# Altium project WiFi_Card_V1_1.PrjPcb
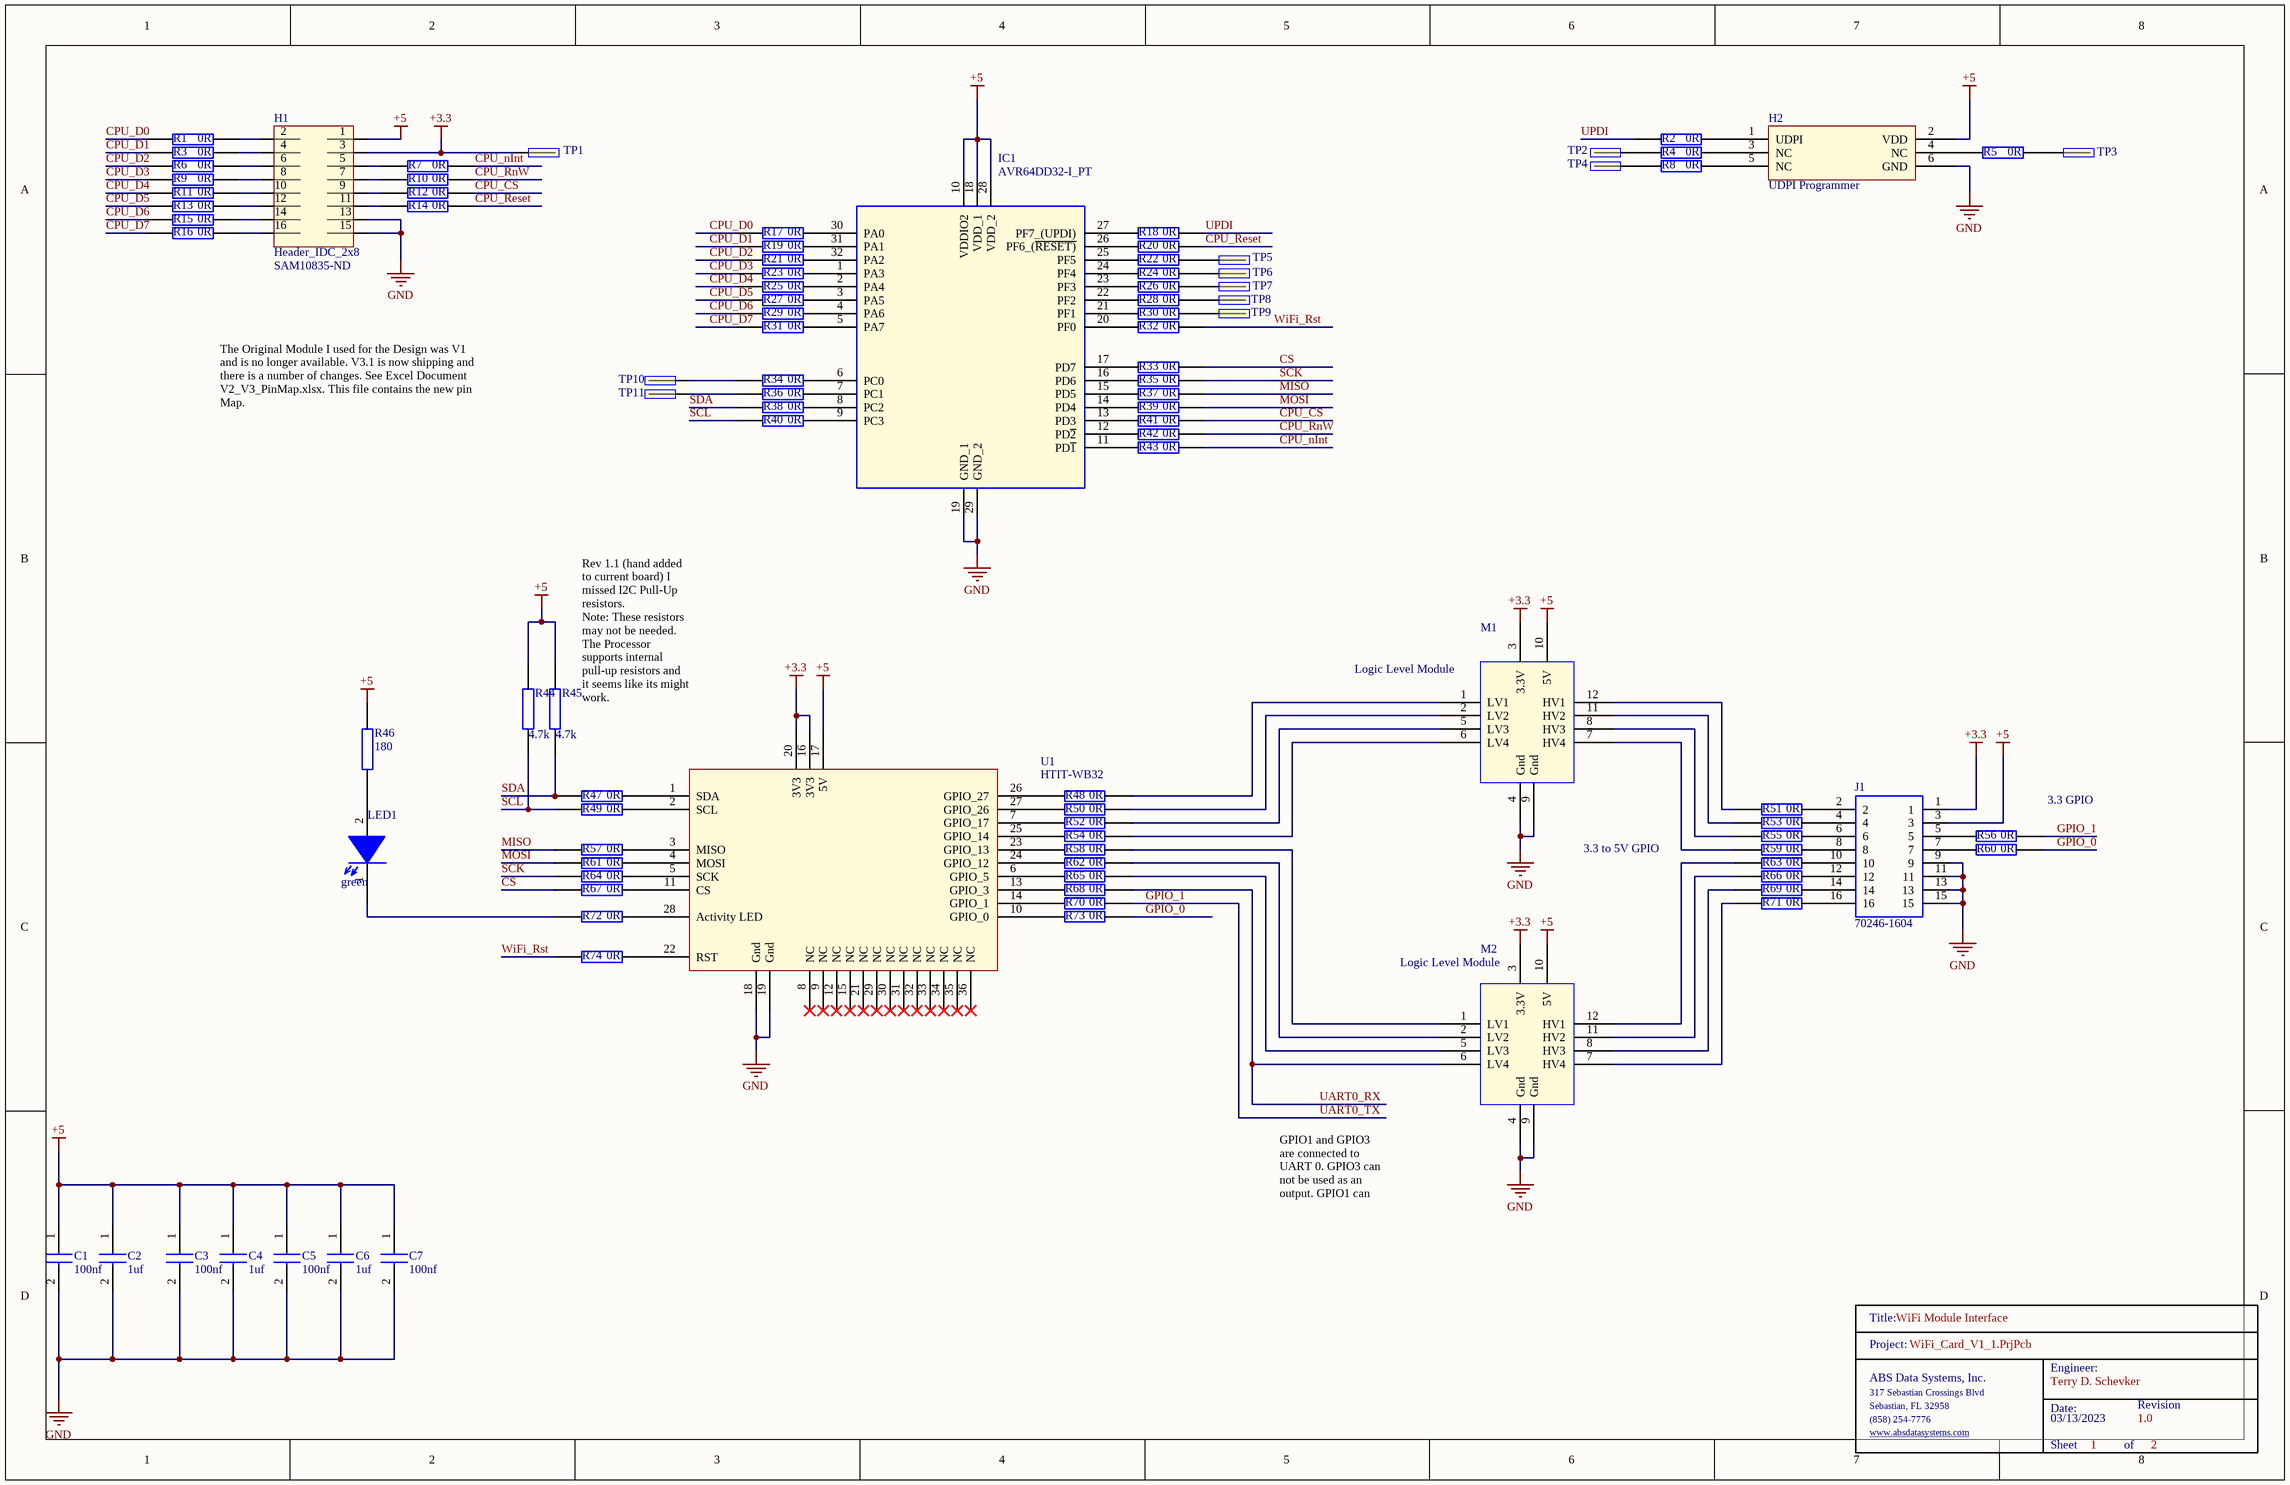
[diagram p0: WiFi_Card.SchDoc]
2 sheets, 153 parts. Net scope: global (net labels, ports and power ports of the same name join across sheets).
Board file: WiFi_Card_PCB.PcbDoc
Sheets:
  WiFi_Card.SchDoc
  WiFi_Card_Led_Monitor.SchDoc

## Sheet WiFi_Card.SchDoc: WiFi Module Interface
size Tabloid; Date: 03/13/2023; Engineer: Terry D. Schevker; Revision: 1.0; SheetNumber: 1; SheetTotal: 2

### Parts
C1  100nf  [0603]
C2  1uf  [0603]
C3  100nf  [0603]
C4  1uf  [0603]
C5  100nf  [0603]
C6  1uf  [0603]
C7  100nf  [0603]
H1  Header_IDC_2x8  Supplier Part Number 1: SAM10835-ND  [HEADER16]
H2  UDPI Programmer  [HDR2X3]
IC1  AVR64DD32-I_PT  [QFP80P900X900X120-32N]
J1  70246-1604  [SHDR16W99P254_2X8_2794X889X927P]
LED1  green  [0603_Diode]
M1  Logic Level Module  [Logic_Level_Module]
M2  Logic Level Module  [Logic_Level_Module]
R1  0R  [0603]
R2  0R  [0603]
R3  0R  [0603]
R4  0R  [0603]
R5  0R  [0603]
R6  0R  [0603]
R7  0R  [0603]
R8  0R  [0603]
R9  0R  [0603]
R10  0R  [0603]
R11  0R  [0603]
R12  0R  [0603]
R13  0R  [0603]
R14  0R  [0603]
R15  0R  [0603]
R16  0R  [0603]
R17  0R  [0603]
R18  0R  [0603]
R19  0R  [0603]
R20  0R  [0603]
R21  0R  [0603]
R22  0R  [0603]
R23  0R  [0603]
R24  0R  [0603]
R25  0R  [0603]
R26  0R  [0603]
R27  0R  [0603]
R28  0R  [0603]
R29  0R  [0603]
R30  0R  [0603]
R31  0R  [0603]
R32  0R  [0603]
R33  0R  [0603]
R34  0R  [0603]
R35  0R  [0603]
R36  0R  [0603]
R37  0R  [0603]
R38  0R  [0603]
R39  0R  [0603]
R40  0R  [0603]
R41  0R  [0603]
R42  0R  [0603]
R43  0R  [0603]
R44  4.7k  [0603]
R45  4.7k  [0603]
R46  180  [0603]
R47  0R  [0603]
R48  0R  [0603]
R49  0R  [0603]
R50  0R  [0603]
R51  0R  [0603]
R52  0R  [0603]
R53  0R  [0603]
R54  0R  [0603]
R55  0R  [0603]
R56  0R  [0603]
R57  0R  [0603]
R58  0R  [0603]
R59  0R  [0603]
R60  0R  [0603]
R61  0R  [0603]
R62  0R  [0603]
R63  0R  [0603]
R64  0R  [0603]
R65  0R  [0603]
R66  0R  [0603]
R67  0R  [0603]
R68  0R  [0603]
R69  0R  [0603]
R70  0R  [0603]
R71  0R  [0603]
R72  0R  [0603]
R73  0R  [0603]
R74  0R  [0603]
TitleBlock_1  TitleBlock  (value not drawn)  (graphical)
TP1  TP  [TP]  (value not drawn)
TP2  TP  [TP]  (value not drawn)
TP3  TP  [TP]  (value not drawn)
TP4  TP  [TP]  (value not drawn)
TP5  TP  [TP]  (value not drawn)
TP6  TP  [TP]  (value not drawn)
TP7  TP  [TP]  (value not drawn)
TP8  TP  [TP]  (value not drawn)
TP9  TP  [TP]  (value not drawn)
TP10  TP  [TP]  (value not drawn)
TP11  TP  [TP]  (value not drawn)
U1  HTIT-WB32  [DIP36Wide]

### Nets
+3.3: H1.3 J1.1 M1.3(3.3V) M2.3(3.3V) TP1.1 U1.16(3V3) U1.20(3V3)
+5: C1.1 C2.1 C3.1 C4.1 C5.1 C6.1 C7.1 H1.1 H2.2(VDD) IC1.10(VDDIO2) IC1.18(VDD_1) IC1.28(VDD_2) J1.3 M1.10(5V) M2.10(5V) R44.2 R45.2 R46.2 U1.17(5V)
GND: C1.2 C2.2 C3.2 C4.2 C5.2 C6.2 C7.2 H1.13 H1.15 H2.6(GND) IC1.19(GND_1) IC1.29(GND_2) J1.9 J1.11 J1.13 J1.15 M1.4(Gnd) M1.9(Gnd) M2.4(Gnd) M2.9(Gnd) U1.18(Gnd) U1.19(Gnd)
CPU_CS: R12.2 R41.2
CPU_D0: R1.1 R17.1
CPU_D1: R3.1 R19.1
CPU_D2: R6.1 R21.1
CPU_D3: R9.1 R23.1
CPU_D4: R11.1 R25.1
CPU_D5: R13.1 R27.1
CPU_D6: R15.1 R29.1
CPU_D7: R16.1 R31.1
CPU_nInt: R7.2 R43.2
CPU_Reset: R14.2 R20.2
CPU_RnW: R10.2 R42.2
CS: R33.2 R67.1
GPIO_0: R60.2 R73.2
GPIO_1: R56.2 R70.2  [also labelled UART0_TX]
MISO: R37.2 R57.1
MOSI: R39.2 R61.1
SCK: R35.2 R64.1
SCL: R40.1 R44.1 R49.1
SDA: R38.1 R45.1 R47.1
UART0_RX: M2.6(LV4) R68.2
UPDI: R2.1 R18.2
WiFi_Rst: R32.2 R74.1
NetH1_2: H1.2 R1.2
NetH1_4: H1.4 R3.2
NetH1_5: H1.5 R7.1
NetH1_6: H1.6 R6.2
NetH1_7: H1.7 R10.1
NetH1_8: H1.8 R9.2
NetH1_9: H1.9 R12.1
NetH1_10: H1.10 R11.2
NetH1_11: H1.11 R14.1
NetH1_12: H1.12 R13.2
NetH1_14: H1.14 R15.2
NetH1_16: H1.16 R16.2
NetH2_1: H2.1(UDPI) R2.2
NetH2_3: H2.3(NC) R4.2
NetH2_4: H2.4(NC) R5.1
NetH2_5: H2.5(NC) R8.2
NetIC1_1: IC1.1(PA3) R23.2
NetIC1_2: IC1.2(PA4) R25.2
NetIC1_3: IC1.3(PA5) R27.2
NetIC1_4: IC1.4(PA6) R29.2
NetIC1_5: IC1.5(PA7) R31.2
NetIC1_6: IC1.6(PC0) R34.2
NetIC1_7: IC1.7(PC1) R36.2
NetIC1_8: IC1.8(PC2) R38.2
NetIC1_9: IC1.9(PC3) R40.2
NetIC1_11: IC1.11(PD~{1}) R43.1
NetIC1_12: IC1.12(PD~{2}) R42.1
NetIC1_13: IC1.13(PD3) R41.1
NetIC1_14: IC1.14(PD4) R39.1
NetIC1_15: IC1.15(PD5) R37.1
NetIC1_16: IC1.16(PD6) R35.1
NetIC1_17: IC1.17(PD7) R33.1
NetIC1_20: IC1.20(PF0) R32.1
NetIC1_21: IC1.21(PF1) R30.1
NetIC1_22: IC1.22(PF2) R28.1
NetIC1_23: IC1.23(PF3) R26.1
NetIC1_24: IC1.24(PF4) R24.1
NetIC1_25: IC1.25(PF5) R22.1
NetIC1_26: IC1.26(PF6_(~{RESET)}) R20.1
NetIC1_27: IC1.27(PF7_(UPDI)) R18.1
NetIC1_30: IC1.30(PA0) R17.2
NetIC1_31: IC1.31(PA1) R19.2
NetIC1_32: IC1.32(PA2) R21.2
NetJ1_2: J1.2 R51.2
NetJ1_4: J1.4 R53.2
NetJ1_5: J1.5 R56.1
NetJ1_6: J1.6 R55.2
NetJ1_7: J1.7 R60.1
NetJ1_8: J1.8 R59.2
NetJ1_10: J1.10 R63.2
NetJ1_12: J1.12 R66.2
NetJ1_14: J1.14 R69.2
NetJ1_16: J1.16 R71.2
NetLED1_1: LED1.1(K) R72.1
NetLED1_2: LED1.2(A) R46.1
NetM1_1: M1.1(LV1) R48.2
NetM1_2: M1.2(LV2) R50.2
NetM1_5: M1.5(LV3) R52.2
NetM1_6: M1.6(LV4) R54.2
NetM1_7: M1.7(HV4) R59.1
NetM1_8: M1.8(HV3) R55.1
NetM1_11: M1.11(HV2) R53.1
NetM1_12: M1.12(HV1) R51.1
NetM2_1: M2.1(LV1) R58.2
NetM2_2: M2.2(LV2) R62.2
NetM2_5: M2.5(LV3) R65.2
NetM2_7: M2.7(HV4) R71.1
NetM2_8: M2.8(HV3) R69.1
NetM2_11: M2.11(HV2) R66.1
NetM2_12: M2.12(HV1) R63.1
NetR4_1: R4.1 TP2.1
NetR5_2: R5.2 TP3.1
NetR8_1: R8.1 TP4.1
NetR22_2: R22.2 TP5.1
NetR24_2: R24.2 TP6.1
NetR26_2: R26.2 TP7.1
NetR28_2: R28.2 TP8.1
NetR30_2: R30.2 TP9.1
NetR34_1: R34.1 TP10.1
NetR36_1: R36.1 TP11.1
NetR47_2: R47.2 U1.1(SDA)
NetR48_1: R48.1 U1.26(GPIO_27)
NetR49_2: R49.2 U1.2(SCL)
NetR50_1: R50.1 U1.27(GPIO_26)
NetR52_1: R52.1 U1.7(GPIO_17)
NetR54_1: R54.1 U1.25(GPIO_14)
NetR57_2: R57.2 U1.3(MISO)
NetR58_1: R58.1 U1.23(GPIO_13)
NetR61_2: R61.2 U1.4(MOSI)
NetR62_1: R62.1 U1.24(GPIO_12)
NetR64_2: R64.2 U1.5(SCK)
NetR65_1: R65.1 U1.6(GPIO_5)
NetR67_2: R67.2 U1.11(CS)
NetR68_1: R68.1 U1.13(GPIO_3)
NetR70_1: R70.1 U1.14(GPIO_1)
NetR72_2: R72.2 U1.28(Activity_LED)
NetR73_1: R73.1 U1.10(GPIO_0)
NetR74_2: R74.2 U1.22(RST)

Not connected (* = marked no-connect by the designer): U1 8(NC)* 9(NC)* 12(NC)* 15(NC)* 21(NC)* 29(NC)* 30(NC)* 31(NC)* 32(NC)* 33(NC)* 34(NC)* 35(NC)* 36(NC)*

### Notes on the sheet
- The Original Module I used for the Design was V1 and is no longer available. V3.1 is now shipping and there is a number of changes. See Excel Document V2_V3_PinMap.xlsx. This file contains the new pin Map.
- (near R45) Rev 1.1 (hand added to current board) I missed I2C Pull-Up resistors.
  Note: These resistors may not be needed. The Processor supports internal pull-up resistors and it seems like its might work.
- 3.3 GPIO
- 3.3 to 5V GPIO
- GPIO1 and GPIO3 are connected to UART 0. GPIO3 can not be used as an output. GPIO1 can be.
- (in symbol TitleBlock) Title:; Project:; Engineer:; ABS Data Systems, Inc.; 317 Sebastian Crossings Blvd; Sebastian, FL 32958; Date:; Revision; (858) 254-7776; www.absdatasystems.com; Sheet; of

### Library data of the parts
C1 C3 C5 C7 = CL10B104JB8NNNC: Samsung Electro-Mechanics 0603 100nf
C2 C4 C6 = CL10B105KA8NNNL: Samsung Electro-Mechanics 0603 1uf
H1 = Header_IDC_2x8: 16 Pin 2x8 Through Hold IDC Connector; Manufacturer: Samtec; Manufacturer Part Number: TST-108-01-G-D; Number of Contacts: 16; Gender: Male; Connector Type: Male Pin; Pitch: 2.54mm; Row Spacing: 0.1inch; Supplier 1: Digi-Key; RoHS: Yes; Category: Headers and Wire Housings; Stock 1: 227; Pricing 1: 1=2.85000, 10=2.73600, 100=2.28000, 500=1.93800, 1000=1.65300, 5000=1.48200 (USD); Mount: Through Hole; Contact Plating: Gold; Contact Material: Bronze; Housing Material: Polyester; Housing Color: Black; Color: Black; Min Operating Temperature: -55°C; Max Operating Temperature: 125°C; Number of Rows: 2; Termination: Solder; Packaging: Rail/Tube; Orientation: Straight; Number of Positions: 16; Length: 27.94mm; Depth: 9.27mm; Contact Mating Length: 0.25inch; REACH SVHC: No SVHC; ComponentLink1URL: https://datasheet.ciiva.com/739/tst-mkt-739845.pdf?src-supplier=Digi-Key; ComponentLink1Description: https://datasheet.ciiva.com/739/tst-mkt-739845.pdf?src-supplier=Digi-Key; ComponentLink2URL: https://datasheet.ciiva.com/10018/htst-10018510.pdf?src-supplier=Avnet; ComponentLink2Description: https://datasheet.ciiva.com/10018/htst-10018510.pdf?src-supplier=Avnet
H2 = UDPI Programmer: 6 Pin 2X3 Through Hole Header
IC1 = AVR64DD32-I_PT: Integrated Circuit; Manufacturer_Name: Microchip; Manufacturer_Part_Number: AVR64DD32-I/PT | MULTI-VOLTAGE I/O; Datasheet Link: https://www.microchip.com/en-us/product/AVR64DD32; Height: 1.2mm
J1 = 70246-1604: Molex C-GRID 70246, 2.54mm Pitch, 16 Way, 2 Row, Straight PCB Header, Through Hole; Geometry.Height: 9.27mm; Mouser Part Number: 538-70246-1604; Mouser Price/Stock: https://www.mouser.co.uk/ProductDetail/Molex/70246-1604?qs=KUIzHt%2Fe91njhb67Cjmalw%3D%3D; Manufacturer_Name: Molex; Manufacturer_Part_Number: 70246-1604; Datasheet Link: https://www.molex.com/pdm_docs/sd/702461604_sd.pdf
LED1 = 150060GS75000: Wurth Elektronik 0603 green; Manufacturer: Wurth Electronics; Wavelength: 520nm; Viewing Angle: 140°; Lens Style: Clear,Rectangular; Luminous Intensity: 430mcd; Forward Current: 30mA; Forward Voltage: 3.2V; Test Current: 20mA; Supplier 1: Digi-Key; Manufacturer Part Number: 150060GS75000; RoHS: Yes; Category: LEDs; Stock 1: 71509; Pricing 1: 1=0.14000, 50=0.13300, 100=0.11400, 500=0.09900 (USD); Mount: Surface Mount; Case/Package: 0603; Color: Green; Case Code (Metric): 1608; Case Code (Imperial): 0603; Min Operating Temperature: -40°C; Max Operating Temperature: 85°C; Package Quantity: 4000; Packaging: Tape and Reel; Dominant Wavelength: 520nm; Length: 1.6mm; Width: 0.8mm; Height: 0.7mm; REACH SVHC: Unknown; Lead Free: Lead Free; ComponentLink1URL: https://datasheet.ciiva.com/29562/150060gs75000-29562868.pdf?src-supplier=Digi-Key; ComponentLink1Description: https://datasheet.ciiva.com/29562/150060gs75000-29562868.pdf?src-supplier=Digi-Key; ComponentLink2URL: https://datasheet.ciiva.com/29279/759427-da-01-en-chipled-0603-w-kl-gruen-150060gs75000-29279201.pdf?src-supplier=Conrad; ComponentLink2Description: https://datasheet.ciiva.com/29279/759427-da-01-en-chipled-0603-w-kl-gruen-150060gs75000-29279201.pdf?src-supplier=Conrad; ComponentLink3URL: https://datasheet.ciiva.com/29562/150060gs75000-29562869.pdf?src-supplier=Digi-Key; ComponentLink3Description: https://datasheet.ciiva.com/29562/150060gs75000-29562869.pdf?src-supplier=Digi-Key; ComponentLink4URL: https://datasheet.ciiva.com/29562/150060gs75000-29562870.pdf?src-supplier=Digi-Key; ComponentLink4Description: https://datasheet.ciiva.com/29562/150060gs75000-29562870.pdf?src-supplier=Digi-Key
M1 M2 = Logic_Level_Module: Logic Level Converter Module
R1-R43 R47-R74 = RC0603JR-070RL: YAGEO 0603 0 ohm; Manufacturer_Name: KEMET; Geometry.Height: 0.55mm; Mouser Part Number: 603-RC0603JR-070RL; Mouser Price/Stock: https://www.mouser.co.uk/ProductDetail/YAGEO/RC0603JR-070RL?qs=2cAdsCoAWRGWyPcuXgGiXQ%3D%3D; Manufacturer_Part_Number: RC0603JR-070RL; Datasheet Link: https://datasheet.datasheetarchive.com/originals/distributors/Datasheets_SAMA/902f9e387b938f871d31120f5fc1d65e.pdf
R44 R45 = RC0603FR-104K7L: YAGEO 0603 4.7k; Manufacturer_Name: KEMET; Manufacturer_Part_Number: RC0603JR-070RL; Geometry.Height: 0.55mm; Mouser Part Number: 603-RC0603JR-070RL; Mouser Price/Stock: https://www.mouser.co.uk/ProductDetail/YAGEO/RC0603JR-070RL?qs=2cAdsCoAWRGWyPcuXgGiXQ%3D%3D; Datasheet Link: https://datasheet.datasheetarchive.com/originals/distributors/Datasheets_SAMA/902f9e387b938f871d31120f5fc1d65e.pdf
R46 = RC0603FR-13180RL: YAGEO 0603 180 ohm; Manufacturer_Name: KEMET; Manufacturer_Part_Number: RC0603JR-070RL; Geometry.Height: 0.55mm; Mouser Part Number: 603-RC0603JR-070RL; Mouser Price/Stock: https://www.mouser.co.uk/ProductDetail/YAGEO/RC0603JR-070RL?qs=2cAdsCoAWRGWyPcuXgGiXQ%3D%3D; Datasheet Link: https://datasheet.datasheetarchive.com/originals/distributors/Datasheets_SAMA/902f9e387b938f871d31120f5fc1d65e.pdf
TP1-TP11 = TP: Manufacturer: Samtec; Manufacturer Part Number: TST-105-01-G-D; Number of Contacts: 16; Gender: Male; Connector Type: Male Pin; Pitch: 2.54mm; Row Spacing: 0.1inch; Supplier 1: Digi-Key; RoHS: Yes; Category: Headers and Wire Housings; Stock 1: 227; Pricing 1: 1=2.85000, 10=2.73600, 100=2.28000, 500=1.93800, 1000=1.65300, 5000=1.48200 (USD); Mount: Through Hole; Contact Plating: Gold; Contact Material: Bronze; Housing Material: Polyester; Housing Color: Black; Color: Black; Min Operating Temperature: -55°C; Max Operating Temperature: 125°C; Number of Rows: 2; Termination: Solder; Packaging: Rail/Tube; Orientation: Straight; Number of Positions: 16; Length: 27.94mm; Depth: 9.27mm; Contact Mating Length: 0.25inch; REACH SVHC: No SVHC; ComponentLink1URL: https://datasheet.ciiva.com/739/tst-mkt-739845.pdf?src-supplier=Digi-Key; ComponentLink1Description: https://datasheet.ciiva.com/739/tst-mkt-739845.pdf?src-supplier=Digi-Key; ComponentLink2URL: https://datasheet.ciiva.com/10018/htst-10018510.pdf?src-supplier=Avnet; ComponentLink2Description: https://datasheet.ciiva.com/10018/htst-10018510.pdf?src-supplier=Avnet
U1 = HTIT-WB32: WIFI Module; ComponentLink1Description: New link; ComponentLink1URL: https://www.amazon.com/gp/product/B07DKD79Y9/ref=ppx_yo_dt_b_asin_title_o00_s00?ie=UTF8&psc=1

## Sheet WiFi_Card_Led_Monitor.SchDoc: WiFi Module LED Monitor
size Tabloid; Date: 05/11/2023; Engineer: Terry D. Schevker; Revision: 1.0; SheetNumber: 2; SheetTotal: 2
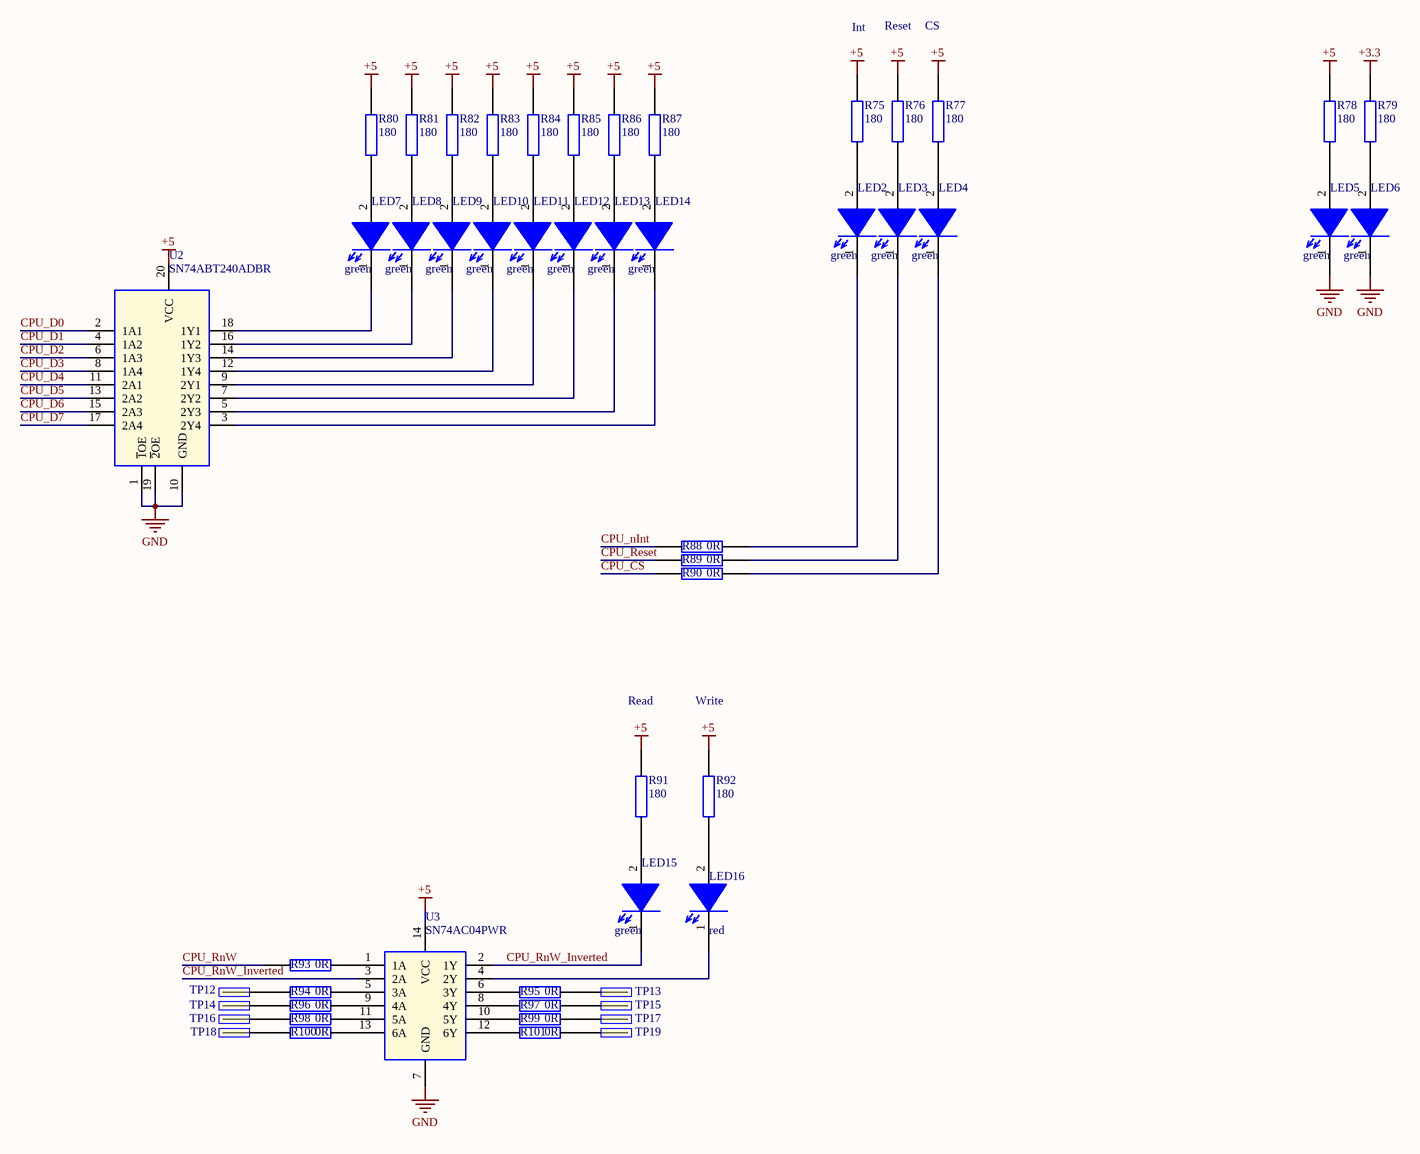
[diagram p1: WiFi_Card_Led_Monitor.SchDoc]

### Parts
LED2  green  [0603_Diode]
LED3  green  [0603_Diode]
LED4  green  [0603_Diode]
LED5  green  [0603_Diode]
LED6  green  [0603_Diode]
LED7  green  [0603_Diode]
LED8  green  [0603_Diode]
LED9  green  [0603_Diode]
LED10  green  [0603_Diode]
LED11  green  [0603_Diode]
LED12  green  [0603_Diode]
LED13  green  [0603_Diode]
LED14  green  [0603_Diode]
LED15  green  [0603_Diode]
LED16  red  [0603_Diode]
R75  180  [0603]
R76  180  [0603]
R77  180  [0603]
R78  180  [0603]
R79  180  [0603]
R80  180  [0603]
R81  180  [0603]
R82  180  [0603]
R83  180  [0603]
R84  180  [0603]
R85  180  [0603]
R86  180  [0603]
R87  180  [0603]
R88  0R  [0603]
R89  0R  [0603]
R90  0R  [0603]
R91  180  [0603]
R92  180  [0603]
R93  0R  [0603]
R94  0R  [0603]
R95  0R  [0603]
R96  0R  [0603]
R97  0R  [0603]
R98  0R  [0603]
R99  0R  [0603]
R100  0R  [0603]
R101  0R  [0603]
TP12  TP  [TP]  (value not drawn)
TP13  TP  [TP]  (value not drawn)
TP14  TP  [TP]  (value not drawn)
TP15  TP  [TP]  (value not drawn)
TP16  TP  [TP]  (value not drawn)
TP17  TP  [TP]  (value not drawn)
TP18  TP  [TP]  (value not drawn)
TP19  TP  [TP]  (value not drawn)
U2  SN74ABT240ADBR  [SOP65P780X200-20N]
U3  SN74AC04PWR  [SOP65P640X120-14N]

### Nets
+3.3: R79.2
+5: R75.2 R76.2 R77.2 R78.2 R80.2 R81.2 R82.2 R83.2 R84.2 R85.2 R86.2 R87.2 R91.2 R92.2 U2.20(VCC) U3.14(VCC)
GND: LED5.1(K) LED6.1(K) U2.1(~{1}OE) U2.10(GND) U2.19(~{2}OE) U3.7(GND)
CPU_CS: R90.1
CPU_D0: U2.2(1A1)
CPU_D1: U2.4(1A2)
CPU_D2: U2.6(1A3)
CPU_D3: U2.8(1A4)
CPU_D4: U2.11(2A1)
CPU_D5: U2.13(2A2)
CPU_D6: U2.15(2A3)
CPU_D7: U2.17(2A4)
CPU_nInt: R88.1
CPU_Reset: R89.1
CPU_RnW: R93.1
CPU_RnW_Inverted: LED15.1(K) U3.2(1Y) U3.3(2A)
NetLED2_1: LED2.1(K) R88.2
NetLED2_2: LED2.2(A) R75.1
NetLED3_1: LED3.1(K) R89.2
NetLED3_2: LED3.2(A) R76.1
NetLED4_1: LED4.1(K) R90.2
NetLED4_2: LED4.2(A) R77.1
NetLED5_2: LED5.2(A) R78.1
NetLED6_2: LED6.2(A) R79.1
NetLED7_1: LED7.1(K) U2.18(1Y1)
NetLED7_2: LED7.2(A) R80.1
NetLED8_1: LED8.1(K) U2.16(1Y2)
NetLED8_2: LED8.2(A) R81.1
NetLED9_1: LED9.1(K) U2.14(1Y3)
NetLED9_2: LED9.2(A) R82.1
NetLED10_1: LED10.1(K) U2.12(1Y4)
NetLED10_2: LED10.2(A) R83.1
NetLED11_1: LED11.1(K) U2.9(2Y1)
NetLED11_2: LED11.2(A) R84.1
NetLED12_1: LED12.1(K) U2.7(2Y2)
NetLED12_2: LED12.2(A) R85.1
NetLED13_1: LED13.1(K) U2.5(2Y3)
NetLED13_2: LED13.2(A) R86.1
NetLED14_1: LED14.1(K) U2.3(2Y4)
NetLED14_2: LED14.2(A) R87.1
NetLED15_2: LED15.2(A) R91.1
NetLED16_1: LED16.1(K) U3.4(2Y)
NetLED16_2: LED16.2(A) R92.1
NetR93_2: R93.2 U3.1(1A)
NetR94_1: R94.1 TP12.1
NetR94_2: R94.2 U3.5(3A)
NetR95_1: R95.1 U3.6(3Y)
NetR95_2: R95.2 TP13.1
NetR96_1: R96.1 TP14.1
NetR96_2: R96.2 U3.9(4A)
NetR97_1: R97.1 U3.8(4Y)
NetR97_2: R97.2 TP15.1
NetR98_1: R98.1 TP16.1
NetR98_2: R98.2 U3.11(5A)
NetR99_1: R99.1 U3.10(5Y)
NetR99_2: R99.2 TP17.1
NetR100_1: R100.1 TP18.1
NetR100_2: R100.2 U3.13(6A)
NetR101_1: R101.1 U3.12(6Y)
NetR101_2: R101.2 TP19.1

### Notes on the sheet
- Int
- Reset
- CS
- Read
- Write

### Library data of the parts
LED2-LED15 = 150060GS75000: as LED1 on sheet WiFi_Card; Supplier 1: Digi-Key; Manufacturer Part Number: 150060GS75000; RoHS: Yes; Category: LEDs; Stock 1: 71509; Pricing 1: 1=0.14000, 50=0.13300, 100=0.11400, 500=0.09900 (USD); Mount: Surface Mount; Case/Package: 0603; Color: Green; Case Code (Metric): 1608; Case Code (Imperial): 0603; Min Operating Temperature: -40°C; Max Operating Temperature: 85°C; Package Quantity: 4000; Packaging: Tape and Reel; Dominant Wavelength: 520nm; Length: 1.6mm; Width: 0.8mm; Height: 0.7mm; REACH SVHC: Unknown; Lead Free: Lead Free; ComponentLink1URL: https://datasheet.ciiva.com/29562/150060gs75000-29562868.pdf?src-supplier=Digi-Key; ComponentLink1Description: https://datasheet.ciiva.com/29562/150060gs75000-29562868.pdf?src-supplier=Digi-Key; ComponentLink2URL: https://datasheet.ciiva.com/29279/759427-da-01-en-chipled-0603-w-kl-gruen-150060gs75000-29279201.pdf?src-supplier=Conrad; ComponentLink2Description: https://datasheet.ciiva.com/29279/759427-da-01-en-chipled-0603-w-kl-gruen-150060gs75000-29279201.pdf?src-supplier=Conrad; ComponentLink3URL: https://datasheet.ciiva.com/29562/150060gs75000-29562869.pdf?src-supplier=Digi-Key; ComponentLink3Description: https://datasheet.ciiva.com/29562/150060gs75000-29562869.pdf?src-supplier=Digi-Key; ComponentLink4URL: https://datasheet.ciiva.com/29562/150060gs75000-29562870.pdf?src-supplier=Digi-Key; ComponentLink4Description: https://datasheet.ciiva.com/29562/150060gs75000-29562870.pdf?src-supplier=Digi-Key
LED16 = 150060RS75000: Wurth Elektronik 0603 red; Manufacturer: Wurth Electronics; Manufacturer Part Number: 150060GS75000; Color: Green; Wavelength: 520nm; Viewing Angle: 140°; Lens Style: Clear,Rectangular; Luminous Intensity: 430mcd; Forward Current: 30mA; Forward Voltage: 3.2V; Test Current: 20mA; Supplier 1: Digi-Key; RoHS: Yes; Category: LEDs; Stock 1: 71509; Pricing 1: 1=0.14000, 50=0.13300, 100=0.11400, 500=0.09900 (USD); Mount: Surface Mount; Case/Package: 0603; Case Code (Metric): 1608; Case Code (Imperial): 0603; Min Operating Temperature: -40°C; Max Operating Temperature: 85°C; Package Quantity: 4000; Packaging: Tape and Reel; Dominant Wavelength: 520nm; Length: 1.6mm; Width: 0.8mm; Height: 0.7mm; REACH SVHC: Unknown; Lead Free: Lead Free; ComponentLink1URL: https://datasheet.ciiva.com/29562/150060gs75000-29562868.pdf?src-supplier=Digi-Key; ComponentLink1Description: https://datasheet.ciiva.com/29562/150060gs75000-29562868.pdf?src-supplier=Digi-Key; ComponentLink2URL: https://datasheet.ciiva.com/29279/759427-da-01-en-chipled-0603-w-kl-gruen-150060gs75000-29279201.pdf?src-supplier=Conrad; ComponentLink2Description: https://datasheet.ciiva.com/29279/759427-da-01-en-chipled-0603-w-kl-gruen-150060gs75000-29279201.pdf?src-supplier=Conrad; ComponentLink3URL: https://datasheet.ciiva.com/29562/150060gs75000-29562869.pdf?src-supplier=Digi-Key; ComponentLink3Description: https://datasheet.ciiva.com/29562/150060gs75000-29562869.pdf?src-supplier=Digi-Key; ComponentLink4URL: https://datasheet.ciiva.com/29562/150060gs75000-29562870.pdf?src-supplier=Digi-Key; ComponentLink4Description: https://datasheet.ciiva.com/29562/150060gs75000-29562870.pdf?src-supplier=Digi-Key
R75-R87 R91 R92 = RC0603FR-13180RL: as R46 on sheet WiFi_Card; Mouser Part Number: 603-RC0603JR-070RL; Mouser Price/Stock: https://www.mouser.co.uk/ProductDetail/YAGEO/RC0603JR-070RL?qs=2cAdsCoAWRGWyPcuXgGiXQ%3D%3D; Datasheet Link: https://datasheet.datasheetarchive.com/originals/distributors/Datasheets_SAMA/902f9e387b938f871d31120f5fc1d65e.pdf
R88-R90 R93-R101 = RC0603JR-070RL: as R1 on sheet WiFi_Card; Mouser Part Number: 603-RC0603JR-070RL; Mouser Price/Stock: https://www.mouser.co.uk/ProductDetail/YAGEO/RC0603JR-070RL?qs=2cAdsCoAWRGWyPcuXgGiXQ%3D%3D; Manufacturer_Part_Number: RC0603JR-070RL; Datasheet Link: https://datasheet.datasheetarchive.com/originals/distributors/Datasheets_SAMA/902f9e387b938f871d31120f5fc1d65e.pdf
TP12-TP19 = TP: as TP1 on sheet WiFi_Card; Supplier 1: Digi-Key; RoHS: Yes; Category: Headers and Wire Housings; Stock 1: 227; Pricing 1: 1=2.85000, 10=2.73600, 100=2.28000, 500=1.93800, 1000=1.65300, 5000=1.48200 (USD); Mount: Through Hole; Contact Plating: Gold; Contact Material: Bronze; Housing Material: Polyester; Housing Color: Black; Color: Black; Min Operating Temperature: -55°C; Max Operating Temperature: 125°C; Number of Rows: 2; Termination: Solder; Packaging: Rail/Tube; Orientation: Straight; Number of Positions: 16; Length: 27.94mm; Depth: 9.27mm; Contact Mating Length: 0.25inch; REACH SVHC: No SVHC; ComponentLink1URL: https://datasheet.ciiva.com/739/tst-mkt-739845.pdf?src-supplier=Digi-Key; ComponentLink1Description: https://datasheet.ciiva.com/739/tst-mkt-739845.pdf?src-supplier=Digi-Key; ComponentLink2URL: https://datasheet.ciiva.com/10018/htst-10018510.pdf?src-supplier=Avnet; ComponentLink2Description: https://datasheet.ciiva.com/10018/htst-10018510.pdf?src-supplier=Avnet
U2 = SN74ABT240ADBR: Octal Buffers/Drivers With 3-State Outputs; Manufacturer_Name: Texas Instruments; Geometry.Height: 2mm; Mouser Part Number: 595-SN74ABT240ADBR; Mouser Price/Stock: https://www.mouser.co.uk/ProductDetail/Texas-Instruments/SN74ABT240ADBR?qs=JHHQeKcAU3Dt82k%252BVyiYdw%3D%3D; Manufacturer_Part_Number: SN74ABT240ADBR; Datasheet Link: http://www.ti.com/lit/gpn/sn74abt240a
U3 = SN74AC04PWR: Hex Inverters; Manufacturer_Name: Texas Instruments; Geometry.Height: 1.2mm; Mouser Part Number: 595-SN74AC04PWR; Mouser Price/Stock: https://www.mouser.co.uk/ProductDetail/Texas-Instruments/SN74AC04PWR?qs=RZS%252BpEsUn7pRvPNqsga4SA%3D%3D; Manufacturer_Part_Number: SN74AC04PWR; Datasheet Link: http://www.ti.com/lit/gpn/sn74ac04

## Nets that join several sheets
+3.3: WiFi_Card (7 pins), WiFi_Card_Led_Monitor (R79.2)
+5: WiFi_Card (19 pins), WiFi_Card_Led_Monitor (16 pins)
GND: WiFi_Card (22 pins), WiFi_Card_Led_Monitor (6 pins)
CPU_CS: WiFi_Card (R12.2 R41.2), WiFi_Card_Led_Monitor (R90.1)
CPU_D0: WiFi_Card (R1.1 R17.1), WiFi_Card_Led_Monitor (U2.2)
CPU_D1: WiFi_Card (R3.1 R19.1), WiFi_Card_Led_Monitor (U2.4)
CPU_D2: WiFi_Card (R6.1 R21.1), WiFi_Card_Led_Monitor (U2.6)
CPU_D3: WiFi_Card (R9.1 R23.1), WiFi_Card_Led_Monitor (U2.8)
CPU_D4: WiFi_Card (R11.1 R25.1), WiFi_Card_Led_Monitor (U2.11)
CPU_D5: WiFi_Card (R13.1 R27.1), WiFi_Card_Led_Monitor (U2.13)
CPU_D6: WiFi_Card (R15.1 R29.1), WiFi_Card_Led_Monitor (U2.15)
CPU_D7: WiFi_Card (R16.1 R31.1), WiFi_Card_Led_Monitor (U2.17)
CPU_nInt: WiFi_Card (R7.2 R43.2), WiFi_Card_Led_Monitor (R88.1)
CPU_Reset: WiFi_Card (R14.2 R20.2), WiFi_Card_Led_Monitor (R89.1)
CPU_RnW: WiFi_Card (R10.2 R42.2), WiFi_Card_Led_Monitor (R93.1)